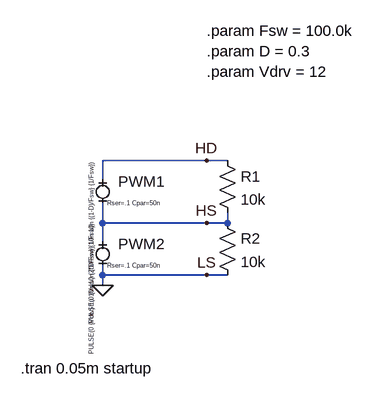
[diagram p0: schematic Draft1.asc]
Draft1.asc, the LTspice schematic file:
Version 4
SHEET 1 880 680
WIRE 272 64 112 64
WIRE 304 64 272 64
WIRE 112 96 112 64
WIRE 112 160 112 128
WIRE 272 160 112 160
WIRE 304 160 304 144
WIRE 304 160 272 160
WIRE 112 192 112 160
WIRE 112 240 112 224
WIRE 272 240 112 240
WIRE 304 240 272 240
WIRE 112 256 112 240
FLAG 112 256 0
FLAG 272 240 LS
FLAG 272 160 HS
FLAG 272 64 HD
SYMBOL res 288 144 R0
SYMATTR InstName R2
SYMATTR Value 10k
SYMBOL MiniSyms4\\voltage- 112 208 R0
WINDOW 3 -17 -49 VRight 0
WINDOW 123 0 0 Left 0
WINDOW 39 7 17 Left 0
SYMATTR Value PULSE(0 {Vdrv} 1u 10n 10n {D/Fsw} {1/Fsw})
SYMATTR SpiceLine Rser=.1 Cpar=50n
SYMATTR InstName PWM2
SYMBOL MiniSyms4\\voltage- 112 112 R0
WINDOW 3 -17 -49 VRight 0
WINDOW 123 0 0 Left 0
WINDOW 39 7 17 Left 0
SYMATTR Value PULSE(0 {Vdrv} {2*D/Fsw} 10n 10n {(1-D)/Fsw} {1/Fsw})
SYMATTR SpiceLine Rser=.1 Cpar=50n
SYMATTR InstName PWM1
SYMBOL res 288 48 R0
SYMATTR InstName R1
SYMATTR Value 10k
TEXT 272 -136 Left 2 !.param Fsw = 100.0k\n.param D = 0.3\n.param Vdrv = 12
TEXT -14 384 Left 2 !.tran 0.05m startup

The netlist it stands for:
* Draft1.asc
R2 HS 0 10k
V§PWM2 HS 0 PULSE(0 {Vdrv} 1u 10n 10n {D/Fsw} {1/Fsw}) Rser=.1 Cpar=50n
V§PWM1 HD HS PULSE(0 {Vdrv} {2*D/Fsw} 10n 10n {(1-D)/Fsw} {1/Fsw}) Rser=.1 Cpar=50n
R1 HD HS 10k
.param Fsw = 100.0k
.param D = 0.3
.param Vdrv = 12
.tran 0.05m startup
.backanno
.end